# Altium schematic sheet BW1098FFC_TopLevel.SchDoc: =project_title
size Tabloid; PageSetup: Record=PageOptions|CenterHorizontal=True|CenterVertical=True|PrintScale=0.73|XCorrection=1.00|YCorrection=1.00|PrintKind=0|BorderSize=5000000|LeftOffset=0|BottomOffset=0|Orientation=2|PaperLength=1000|PaperWidth=1000|Scale=100|PaperSource=7|PrintQuality=-4|MediaType=1|DitherType=10|PaperKind=A4|PrintScaleMode=1; CompanyName: Luxonis Holding; Organization: Luxonis Holding; Address1: 1925 Harmony Park Drive; Address2: Westminster, CO; Address3: 80234; Address4: United States; SheetNumber: 2; SheetTotal: 5
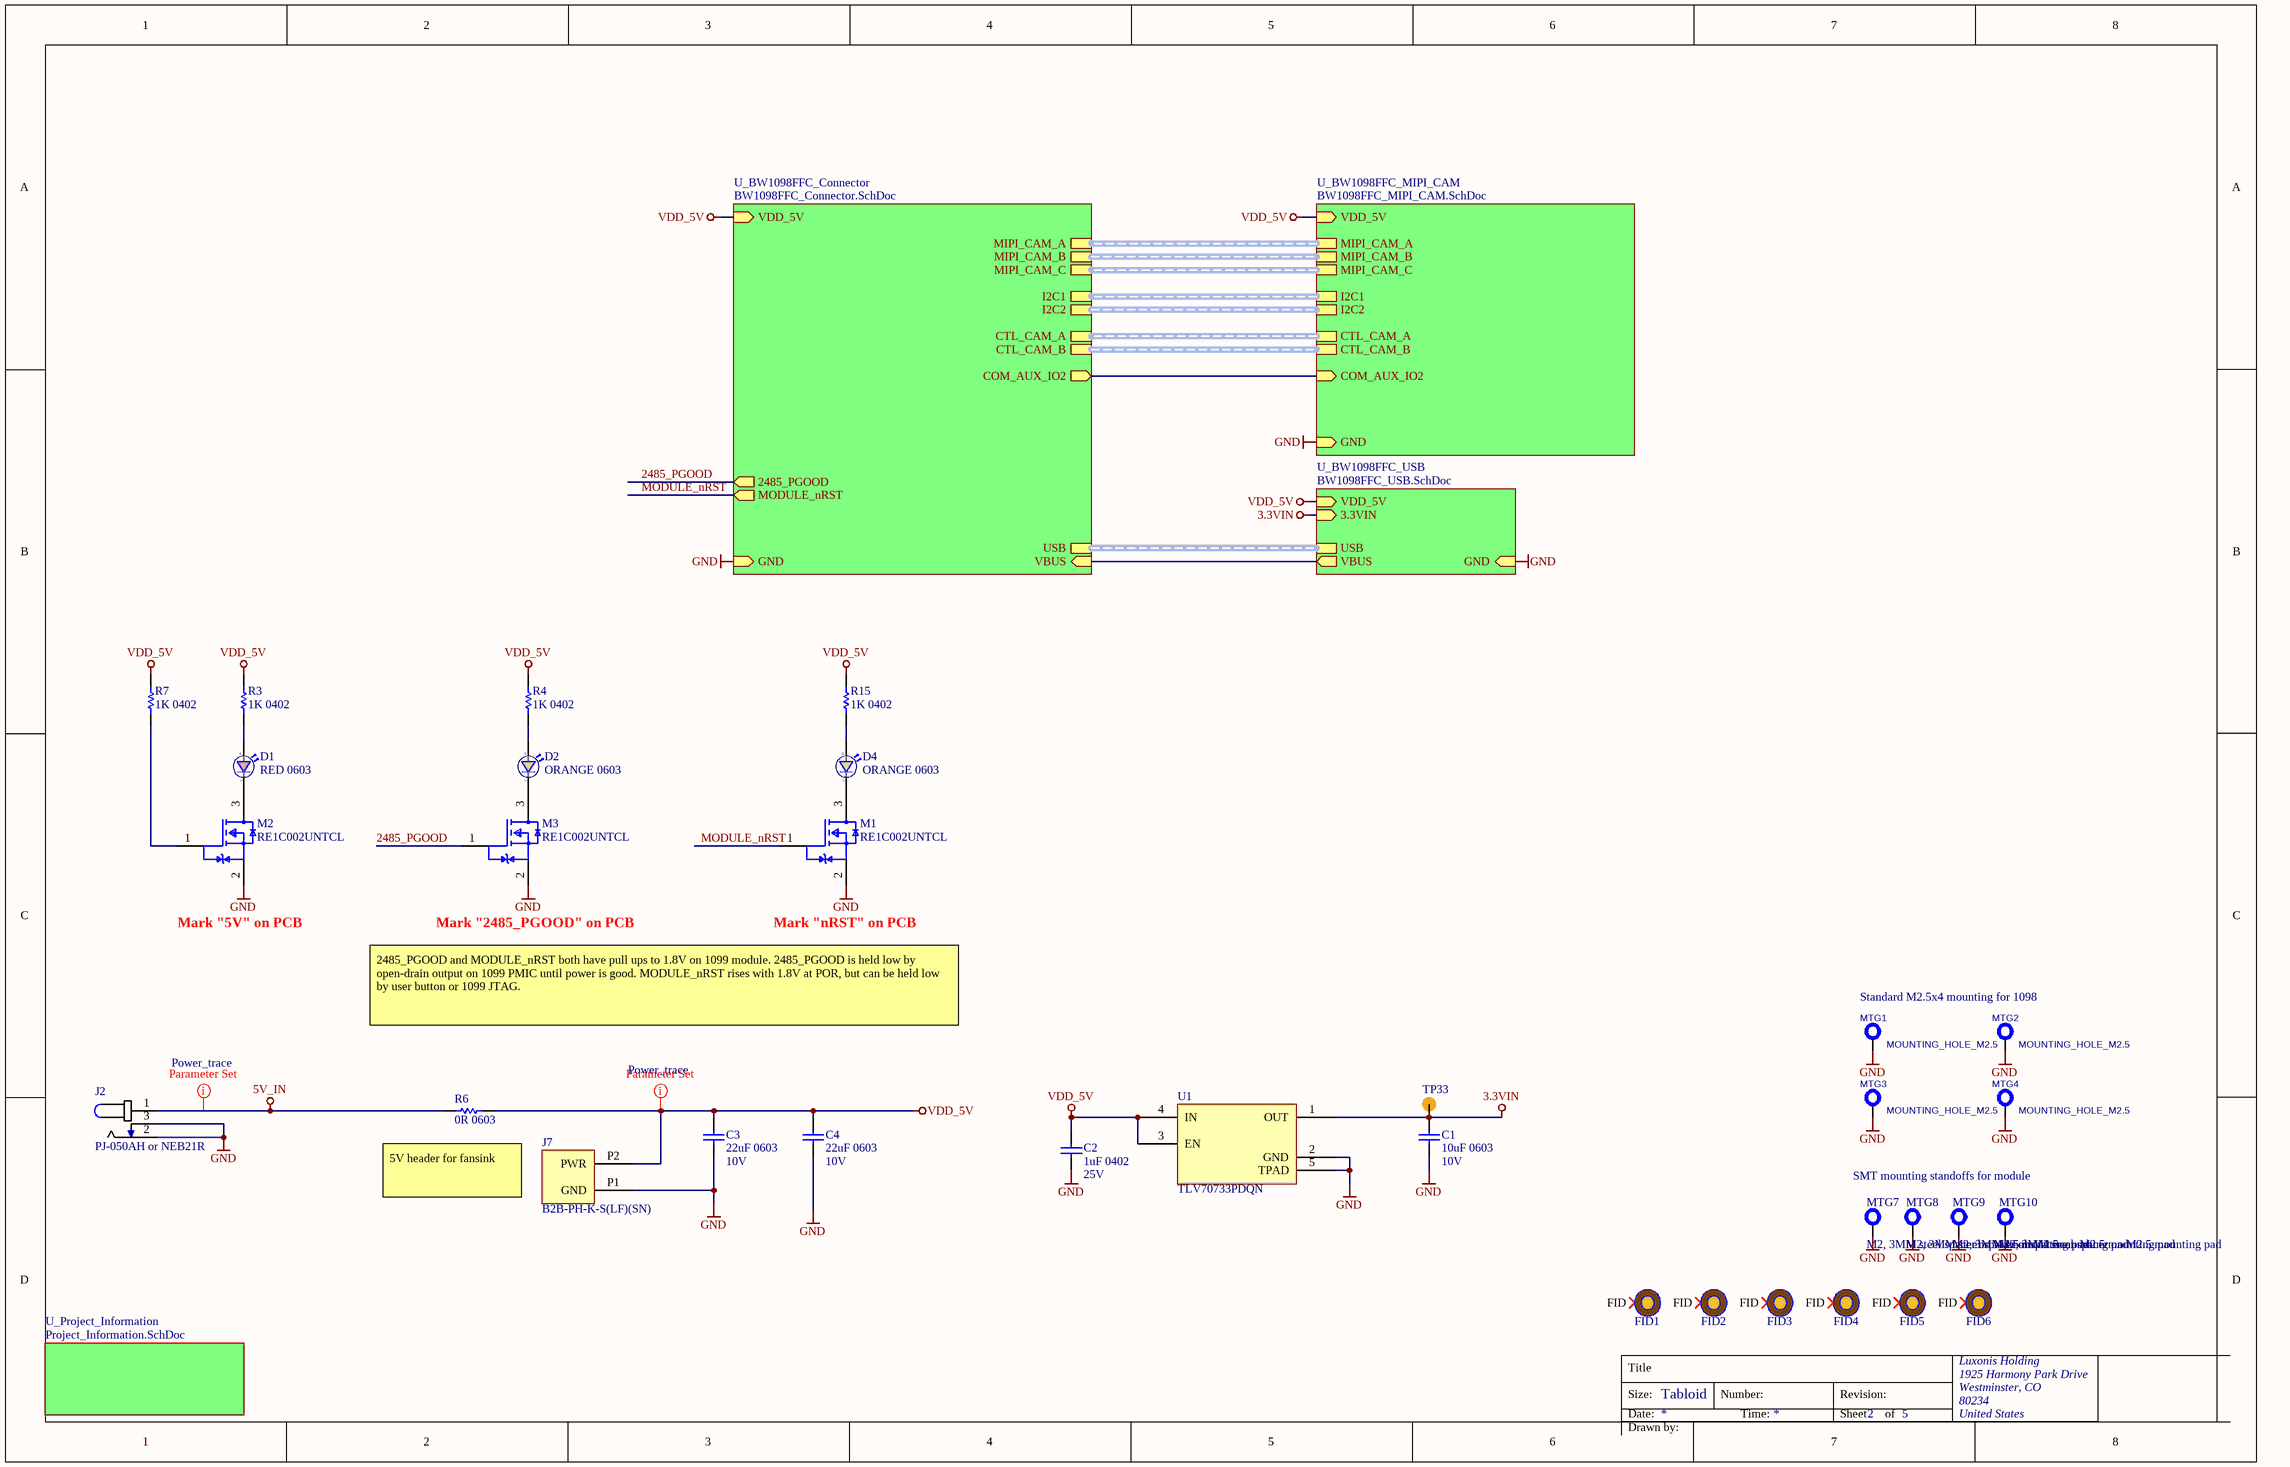
[diagram p0: BW1098FFC_TopLevel.SchDoc]

## Parts
C1  10uF 0603  Voltage Rating: 10V  [CAPC0603(1608)100_N]
C2  1uF 0402  Voltage Rating: 25V  [CAPC0402(1005)70_N]
C3  22uF 0603  Voltage Rating: 10V  [CAPC0603(1608)100_N]
C4  22uF 0603  Voltage Rating: 10V  [CAPC0603(1608)100_N]
D1  RED 0603  [SML_D1xx8W]
D2  ORANGE 0603  [SML_D1xx8W]
D4  ORANGE 0603  [SML_D1xx8W]
FID1  FIDUCIAL_ROUND_1MM  [FIDUCIAL_ROUND_1MM]  (value not drawn)  (no BOM)
FID2  FIDUCIAL_ROUND_1MM  [FIDUCIAL_ROUND_1MM]  (value not drawn)  (no BOM)
FID3  FIDUCIAL_ROUND_1MM  [FIDUCIAL_ROUND_1MM]  (value not drawn)  (no BOM)
FID4  FIDUCIAL_ROUND_1MM  [FIDUCIAL_ROUND_1MM]  (value not drawn)  (no BOM)
FID5  FIDUCIAL_ROUND_1MM  [FIDUCIAL_ROUND_1MM]  (value not drawn)  (no BOM)
FID6  FIDUCIAL_ROUND_1MM  [FIDUCIAL_ROUND_1MM]  (value not drawn)  (no BOM)
J2  PJ-050AH or NEB21R  [PJ-050AH/NEB21R_COMBO]
J7  B2B-PH-K-S(LF)(SN)  [B2B-PH-K-S(LF)(SN)]
M1  RE1C002UNTCL  [RE1C002UNTCL]
M2  RE1C002UNTCL  [RE1C002UNTCL]
M3  RE1C002UNTCL  [RE1C002UNTCL]
MTG1  MOUNTING_HOLE_M2.5  [MOUNTING_HOLE_M2.5]  (no BOM)
MTG2  MOUNTING_HOLE_M2.5  [MOUNTING_HOLE_M2.5]  (no BOM)
MTG3  MOUNTING_HOLE_M2.5  [MOUNTING_HOLE_M2.5]  (no BOM)
MTG4  MOUNTING_HOLE_M2.5  [MOUNTING_HOLE_M2.5]  (no BOM)
MTG7  M2, 3MM steel spacer on M2.5 mounting pad  [9774030243R]
MTG8  M2, 3MM steel spacer on M2.5 mounting pad  [9774030243R]
MTG9  M2, 3MM steel spacer on M2.5 mounting pad  [9774030243R]
MTG10  M2, 3MM steel spacer on M2.5 mounting pad  [9774030243R]
R3  1K 0402  [RESC0402(1005)_N]
R4  1K 0402  [RESC0402(1005)_N]
R6  0R 0603  [RESC0603(1608)_N]
R7  1K 0402  [RESC0402(1005)_N]
R15  1K 0402  [RESC0402(1005)_N]
TP33  TP100_200_NS  [TP100_200_NS]  (value not drawn)  (no BOM)
U1  TLV70733PDQN  [TLV70733PDQN]

## Sub-sheets
U_BW1098FFC_Connector = BW1098FFC_Connector.SchDoc: MIPI_CAM_B (harness MIPI_CAM_B), MIPI_CAM_A (harness MIPI_CAM_A), MIPI_CAM_C (harness MIPI_CAM_C), I2C2 (harness I2C2), I2C1 (harness I2C1), VDD_5V (in), GND (in), 2485_PGOOD (out), MODULE_nRST (out), VBUS (in), COM_AUX_IO2 (out), CTL_CAM_B (harness CTL_CAM_B), CTL_CAM_A (harness CTL_CAM_A), USB (harness USB)
U_BW1098FFC_MIPI_CAM = BW1098FFC_MIPI_CAM.SchDoc: MIPI_CAM_B (harness MIPI_CAM_B), I2C2 (harness I2C2), I2C1 (harness I2C1), MIPI_CAM_A (harness MIPI_CAM_A), MIPI_CAM_C (harness MIPI_CAM_C), VDD_5V (in), GND (in), CTL_CAM_B (harness CTL_CAM_B), CTL_CAM_A (harness CTL_CAM_A), COM_AUX_IO2 (in)
U_BW1098FFC_USB = BW1098FFC_USB.SchDoc: VBUS (out), GND (in), 3.3VIN (in), VDD_5V (in), USB (harness USB)
U_Project_Information = Project_Information.SchDoc: no entries

## Nets
3.3VIN: C1.2 TP33.1 U1.1(OUT) ; sheet U_BW1098FFC_USB/3.3VIN
5V_IN: J2.1 R6.1
GND: C1.1 C2.1 C3.1 C4.1 J2.2 J2.3 J7.P1(GND) M1.2(Source) M2.2(Source) M3.2(Source) MTG1.1 MTG2.1 MTG3.1 MTG4.1 MTG7.1 MTG8.1 MTG9.1 MTG10.1 U1.2(GND) U1.5(TPAD) ; sheet U_BW1098FFC_Connector/GND, sheet U_BW1098FFC_USB/GND, sheet U_BW1098FFC_MIPI_CAM/GND
VDD_5V: C2.2 C3.2 C4.2 J7.P2(PWR) R3.2 R4.2 R6.2 R7.2 R15.2 U1.3(EN) U1.4(IN) ; sheet U_BW1098FFC_Connector/VDD_5V, sheet U_BW1098FFC_USB/VDD_5V, sheet U_BW1098FFC_MIPI_CAM/VDD_5V
2485_PGOOD: M3.1(Gate) ; sheet U_BW1098FFC_Connector/2485_PGOOD
MODULE_nRST: M1.1(Gate) ; sheet U_BW1098FFC_Connector/MODULE_nRST
NetD1_1: D1.1(C) M2.3(Drain)
NetD1_2: D1.2(A) R3.1
NetD2_1: D2.1(C) M3.3(Drain)
NetD2_2: D2.2(A) R4.1
NetD4_1: D4.1(C) M1.3(Drain)
NetD4_2: D4.2(A) R15.1
NetM2_1: M2.1(Gate) R7.1
(unnamed): sheet U_BW1098FFC_Connector/VBUS, sheet U_BW1098FFC_USB/VBUS
(unnamed): sheet U_BW1098FFC_Connector/COM_AUX_IO2, sheet U_BW1098FFC_MIPI_CAM/COM_AUX_IO2

Not connected (* = marked no-connect by the designer): FID1 FID*; FID2 FID*; FID3 FID*; FID4 FID*; FID5 FID*; FID6 FID*

## Buses and harness runs
harness sheet U_BW1098FFC_Connector/CTL_CAM_A = sheet U_BW1098FFC_MIPI_CAM/CTL_CAM_A
harness sheet U_BW1098FFC_Connector/CTL_CAM_B = sheet U_BW1098FFC_MIPI_CAM/CTL_CAM_B
harness sheet U_BW1098FFC_Connector/I2C1 = sheet U_BW1098FFC_MIPI_CAM/I2C1
harness sheet U_BW1098FFC_Connector/I2C2 = sheet U_BW1098FFC_MIPI_CAM/I2C2
harness sheet U_BW1098FFC_Connector/MIPI_CAM_A = sheet U_BW1098FFC_MIPI_CAM/MIPI_CAM_A
harness sheet U_BW1098FFC_Connector/MIPI_CAM_B = sheet U_BW1098FFC_MIPI_CAM/MIPI_CAM_B
harness sheet U_BW1098FFC_Connector/MIPI_CAM_C = sheet U_BW1098FFC_MIPI_CAM/MIPI_CAM_C
harness sheet U_BW1098FFC_Connector/USB = sheet U_BW1098FFC_USB/USB

## Layout directives
net class Power_trace: 5V_IN, VDD_5V

## Notes on the sheet
- Mark "5V" on PCB
- Mark "2485_PGOOD" on PCB
- Mark "nRST" on PCB
- 2485_PGOOD and MODULE_nRST both have pull ups to 1.8V on 1099 module. 2485_PGOOD is held low by open-drain output on 1099 PMIC until power is good. MODULE_nRST rises with 1.8V at POR, but can be held low by user button or 1099 JTAG.
- Standard M2.5x4 mounting for 1098
- (near R6) 5V header for fansink
- SMT mounting standoffs for module
- Title
- Size:
- Date:
- Tabloid
- Number:
- Time:
- Revision:
- Sheet
- of
- Drawn by:

## Library data of the parts
C1 = GRM188R61A106ME69D: CAP CER 10UF 10V X5R 0603 20%; Manufacturer 1: Murata; Material: Ceramic; Supplier 1: Digi-Key; Manufacturer Part Number 1: GRM188R61A106ME69D; Stock 1: 2873098; Pricing 1: 1=0.21000, 10=0.14100, 100=0.07130, 500=0.04876, 1000=0.04313 (USD); RoHS: Yes; Mount: Surface Mount; Case/Package: 0603; Weight: 0.000222oz; Case Code (Metric): 1608; Case Code (Imperial): 0603; Min Operating Temperature: -55°C; Max Operating Temperature: 85°C; Packaging: Tape and Reel; Tolerance: 20%; Capacitance: 10uF; Dielectric: X5R; Voltage Rating (DC): 10V; Package Quantity: 4000; Termination: SMD/SMT; Length: 1.6mm; Height: 0.8mm; Width: 0.8mm; Thickness: 0.035inch; Depth: 0.8mm; REACH SVHC: Unknown; Lead Free: Lead Free; ComponentLink1URL: http://www.mouser.com/ds/2/281/c02e-2905.pdf?src-supplier=Mouser; ComponentLink1Description: http://www.mouser.com/ds/2/281/c02e-2905.pdf?src-supplier=Mouser; ComponentLink2URL: http://components.arrow.com/part/dataview/0323_06119472?src-supplier=Arrow+Europe; ComponentLink2Description: http://components.arrow.com/part/dataview/0323_06119472?src-supplier=Arrow+Europe; ComponentLink3URL: http://www.farnell.com/datasheets/2048014.pdf?src-supplier=Farnell; ComponentLink3Description: http://www.farnell.com/datasheets/2048014.pdf?src-supplier=Farnell; ComponentLink4URL: http://www.farnell.com/datasheets/1872210.pdf?src-supplier=Farnell; ComponentLink4Description: http://www.farnell.com/datasheets/1872210.pdf?src-supplier=Farnell; ComponentLink5URL: http://search.murata.co.jp/Ceramy/image/img/A01X/G101/ENG/GRM188R61A106ME69-01.pdf?src-supplier=Digi-Key; ComponentLink5Description: http://search.murata.co.jp/Ceramy/image/img/A01X/G101/ENG/GRM188R61A106ME69-01.pdf?src-supplier=Digi-Key; ComponentLink6URL: http://www.farnell.com/datasheets/1872210.pdf?src-supplier=Newark; ComponentLink6Description: http://www.farnell.com/datasheets/1872210.pdf?src-supplier=Newark; ComponentLink7URL: http://www.farnell.com/datasheets/2048014.pdf?src-supplier=Element14; ComponentLink7Description: http://www.farnell.com/datasheets/2048014.pdf?src-supplier=Element14; ComponentLink8URL: http://www.farnell.com/datasheets/2048014.pdf?src-supplier=Newark; ComponentLink8Description: http://www.farnell.com/datasheets/2048014.pdf?src-supplier=Newark; Supplier Part Number 1: 490-10475-1-ND
C2 = GRM155R61E105KA12D: CAP CER 1UF 25V X5R 0402 10%; Manufacturer 1: Murata; Material: Ceramic; Supplier 1: Digi-Key; Manufacturer Part Number 1: GRM155R61E105KA12D; Stock 1: 200653; Pricing 1: 1=0.10000, 10=0.07100, 100=0.03350, 500=0.02352, 1000=0.01947, 2500=0.01812, 5000=0.01658 (USD); RoHS: Yes; Mount: Surface Mount; Case/Package: 0402; Weight: 0.000212oz; Case Code (Metric): 1005; Case Code (Imperial): 0402; Min Operating Temperature: -55°C; Max Operating Temperature: 85°C; Tolerance: 10%; Capacitance: 1uF; Dielectric: X5R; Voltage Rating (DC): 25V; Packaging: Tape and Reel; Package Quantity: 10000; Termination: SMD/SMT; Voltage: 25V; Length: 1mm; Height: 0.5mm; Width: 0.5mm; Thickness: 0.022inch; Depth: 0.5mm; Lead Free: Lead Free; REACH SVHC: No SVHC; ComponentLink1URL: https://datasheet.ciiva.com/22732/1666664-22732122.pdf?src-supplier=Element14; ComponentLink1Description: https://datasheet.ciiva.com/22732/1666664-22732122.pdf?src-supplier=Element14; ComponentLink2URL: https://datasheet.ciiva.com/7719/1666664-7719006.pdf?src-supplier=Element14; ComponentLink2Description: https://datasheet.ciiva.com/7719/1666664-7719006.pdf?src-supplier=Element14; Supplier Part Number 1: 490-10017-1-ND
C3 C4 = GRM188R61A226ME15D: CAP CER 22UF 10V X5R 0603 20%; Manufacturer 1: Murata; Material: Ceramic; ComponentLink1URL: https://datasheet.ciiva.com/46444/1769893-46444975.pdf?src-supplier=Element14; ComponentLink1Description: https://datasheet.ciiva.com/46444/1769893-46444975.pdf?src-supplier=Element14; Supplier 1: Digi-Key; Manufacturer Part Number 1: GRM188R61A226ME15D; Stock 1: 984716; Pricing 1: 1=0.31000, 10=0.21500, 100=0.12160, 500=0.08584, 1000=0.07512 (USD); RoHS: Yes; Mount: Surface Mount; Case/Package: 0603; Weight: 0.000222oz; Case Code (Metric): 1608; Case Code (Imperial): 0603; Min Operating Temperature: -55°C; Max Operating Temperature: 85°C; Capacitance: 22uF; Tolerance: 20%; Packaging: Tape and Reel; Dielectric: X5R; Voltage Rating (DC): 10V; Termination: SMD/SMT; Package Quantity: 4000; Length: 1.6mm; Height: 0.8mm; Width: 0.8mm; Thickness: 0.039inch; Depth: 0.8mm; REACH SVHC: No SVHC; Lead Free: Lead Free; Supplier Part Number 1: 490-10476-1-ND
D1 = SML-D12U8WT86: LED RED DIFFUSED 0603 SMD Red 620nm LED Indication - Discrete 2.2V 0603 (1608 Metric); Manufacturer 1: Rohm; Lens Color: White,Clear,Diffused; Lens Style: Rectangular,Diffused,Colorless; Forward Current: 20mA; Luminous Intensity: 63mcd; Number of LEDs: 1; Viewing Angle: 160°; RoHS: Yes; Mount: Surface Mount; Case/Package: 0603; Number of Pins: 2; Color: Red; Case Code (Metric): 1608; Case Code (Imperial): 0603; Min Operating Temperature: -40°C; Max Operating Temperature: 85°C; Forward Voltage: 2.2V; Packaging: Tape and Reel; Dominant Wavelength: 620nm; Wavelength: 620nm; Package Quantity: 1; Illumination Color: Red; Test Current: 20mA; Lens Transparency: Diffused; Length: 1.6mm; Height: 0.65mm; Width: 0.8mm; Radiation Hardening: No; REACH SVHC: No SVHC; Lead Free: Lead Free; ComponentLink1URL: https://datasheet.ciiva.com/11774/0900766b80df3ada-11774020.pdf?src-supplier=RSComponents; ComponentLink1Description: https://datasheet.ciiva.com/11774/0900766b80df3ada-11774020.pdf?src-supplier=RSComponents; ComponentLink2URL: https://datasheet.ciiva.com/2110/sml-d1-2110375.pdf?src-supplier=Digi-Key; ComponentLink2Description: https://datasheet.ciiva.com/2110/sml-d1-2110375.pdf?src-supplier=Digi-Key; ComponentLink3URL: https://datasheet.ciiva.com/2110/sml-d1-2110376.pdf?src-supplier=Digi-Key; ComponentLink3Description: https://datasheet.ciiva.com/2110/sml-d1-2110376.pdf?src-supplier=Digi-Key; ComponentLink4URL: https://datasheet.ciiva.com/2110/sml-d1-2110377.pdf?src-supplier=Digi-Key; ComponentLink4Description: https://datasheet.ciiva.com/2110/sml-d1-2110377.pdf?src-supplier=Digi-Key; ComponentLink5URL: https://datasheet.ciiva.com/9324/sml-d1-9324826.pdf?src-supplier=Avnet; ComponentLink5Description: https://datasheet.ciiva.com/9324/sml-d1-9324826.pdf?src-supplier=Avnet; ComponentLink6URL: https://datasheet.ciiva.com/17420/sml-d1-17420939.pdf?src-supplier=Avnet+Europe; ComponentLink6Description: https://datasheet.ciiva.com/17420/sml-d1-17420939.pdf?src-supplier=Avnet+Europe; Supplier 1: Digi-Key; Manufacturer Part Number 1: SML-D12U8WT86; Stock 1: 63748; Pricing 1: 1=0.33000, 10=0.23900, 100=0.11340, 500=0.07560, 1000=0.05922 (USD); Supplier Part Number 1: 511-1580-1-ND
D2 D4 = SML-D12D8WT86: LED ORANGE DIFFUSED 0603 SMD Orange 605nm LED Indication - Discrete 2.2V 0603 (1608 Metric); Manufacturer 1: Rohm; Lens Color: White; Lens Style: Diffused,Colorless,Rectangular; Number of LEDs: 1; Viewing Angle: 160°; Forward Current: 20mA; Luminous Intensity: 100mcd; Supplier 1: Digi-Key; Stock 1: 29355; Pricing 1: 1=0.33000, 10=0.23900, 100=0.11340, 500=0.07560, 1000=0.05922 (USD); RoHS: Yes; Mount: Surface Mount; Case/Package: 0603; Number of Pins: 2; Color: Orange; Case Code (Metric): 1608; Case Code (Imperial): 0603; Min Operating Temperature: -40°C; Max Operating Temperature: 85°C; Dominant Wavelength: 605nm; Forward Voltage: 2.2V; Package Quantity: 1; Packaging: Tape and Reel; Illumination Color: Orange; Test Current: 20mA; Lens Transparency: Diffused; Wavelength: 605nm; Length: 1.6mm; Height: 0.65mm; Width: 0.8mm; Radiation Hardening: No; REACH SVHC: Unknown; Lead Free: Lead Free; ComponentLink1URL: https://datasheet.ciiva.com/2115/sml-d1-2115577.pdf?src-supplier=Digi-Key; ComponentLink1Description: https://datasheet.ciiva.com/2115/sml-d1-2115577.pdf?src-supplier=Digi-Key; ComponentLink2URL: https://datasheet.ciiva.com/2115/sml-d1-2115578.pdf?src-supplier=Digi-Key; ComponentLink2Description: https://datasheet.ciiva.com/2115/sml-d1-2115578.pdf?src-supplier=Digi-Key; ComponentLink3URL: https://datasheet.ciiva.com/3161/sml-d1-3161418.pdf?src-supplier=Avnet; ComponentLink3Description: https://datasheet.ciiva.com/3161/sml-d1-3161418.pdf?src-supplier=Avnet; ComponentLink4URL: https://datasheet.ciiva.com/16387/sml-d1-16387850.pdf?src-supplier=Future+Electronics; ComponentLink4Description: https://datasheet.ciiva.com/16387/sml-d1-16387850.pdf?src-supplier=Future+Electronics; ComponentLink5URL: https://datasheet.ciiva.com/2115/sml-d1-2115579.pdf?src-supplier=Digi-Key; ComponentLink5Description: https://datasheet.ciiva.com/2115/sml-d1-2115579.pdf?src-supplier=Digi-Key; ComponentLink6URL: https://datasheet.ciiva.com/17419/sml-d1-17419886.pdf?src-supplier=Avnet+Europe; ComponentLink6Description: https://datasheet.ciiva.com/17419/sml-d1-17419886.pdf?src-supplier=Avnet+Europe; Supplier Part Number 1: 511-1577-1-ND; Manufacturer Part Number 1: SML-D12D8WT86
FID1-FID6 = FIDUCIAL: Fiducial with various available footprints
J2 = PJ-050AH/NEB21R_COMBO: CONN POWER PIN 2 POS RA PTH Barrel jack 2.1mm x 5.5mm combo footprint; Manufacturer 1: CUI; Gender: Male; Shielding: Unshielded; Current Rating: 5A; Voltage Rating: 24V; Insulation Resistance: 100MR; Number of Conductors: 2; Max Current Rating: 3A; Voltage Rating (DC): 12V; Number of Ports: 1; Inside Diameter: 6mm; Supplier 1: Mouser; Manufacturer Part Number 1: PJ-050AH; Stock 1: 2665; Pricing 1: 1=0.78000, 10=0.68800, 50=0.62100, 100=0.59400, 1000=0.43200, 10000=0.39100 (USD); Mount: Through Hole; Color: Black; Contact Material: Copper; Contact Plating: Nickel; Housing Color: Black; Housing Material: Thermoplastic; Min Operating Temperature: -25°C; Max Operating Temperature: 85°C; Package Quantity: 500; Termination: Solder; Connector Type: Jack; Contact Gender: Male; Orientation: Horizontal; Lead Free: Lead Free; Flammability Rating: UL94 V-0; ComponentLink1URL: http://www.mouser.com/ds/2/670/PJ-050AH-524150.pdf?src-supplier=Mouser; ComponentLink1Description: http://www.mouser.com/ds/2/670/PJ-050AH-524150.pdf?src-supplier=Mouser; ComponentLink2URL: https://www.cui.com/product/resource/digikeypdf/pj-050ah.pdf?src-supplier=Digi-Key; ComponentLink2Description: https://www.cui.com/product/resource/digikeypdf/pj-050ah.pdf?src-supplier=Digi-Key; ComponentLink3URL: http://datasheet.octopart.com/PJ-050AH-CUI-datasheet-15696426.pdf?src-supplier=CUI; ComponentLink3Description: http://datasheet.octopart.com/PJ-050AH-CUI-datasheet-15696426.pdf?src-supplier=CUI; ComponentLink4URL: http://datasheet.octopart.com/PJ-050AH-CUI-datasheet-62089837.pdf?src-supplier=CUI; ComponentLink4Description: http://datasheet.octopart.com/PJ-050AH-CUI-datasheet-62089837.pdf?src-supplier=CUI; ComponentLink5URL: http://datasheet.octopart.com/PJ-050AH-CUI-datasheet-65972796.pdf?src-supplier=CUI; ComponentLink5Description: http://datasheet.octopart.com/PJ-050AH-CUI-datasheet-65972796.pdf?src-supplier=CUI; ComponentLink6URL: http://datasheet.octopart.com/PJ-050AH-CUI-datasheet-103766550.pdf?src-supplier=CUI; ComponentLink6Description: http://datasheet.octopart.com/PJ-050AH-CUI-datasheet-103766550.pdf?src-supplier=CUI; ComponentLink7URL: http://datasheet.octopart.com/PJ-050AH-CUI-datasheet-103111417.pdf?src-supplier=Electro+Sonic; ComponentLink7Description: http://datasheet.octopart.com/PJ-050AH-CUI-datasheet-103111417.pdf?src-supplier=Electro+Sonic; ComponentLink8URL: http://datasheet.octopart.com/PJ-050AH-CUI-datasheet-34390405.pdf?src-supplier=Future+Electronics; ComponentLink8Description: http://datasheet.octopart.com/PJ-050AH-CUI-datasheet-34390405.pdf?src-supplier=Future+Electronics; ComponentLink9URL: http://datasheet.octopart.com/PJ-050AH-CUI-datasheet-62073522.pdf?src-supplier=Future+Electronics; ComponentLink9Description: http://datasheet.octopart.com/PJ-050AH-CUI-datasheet-62073522.pdf?src-supplier=Future+Electronics; ComponentLink10URL: http://datasheet.octopart.com/PJ-050AH-CUI-datasheet-102985732.pdf?src-supplier=Future+Electronics; ComponentLink10Description: http://datasheet.octopart.com/PJ-050AH-CUI-datasheet-102985732.pdf?src-supplier=Future+Electronics; Supplier 2: Newark; Manufacturer 2: Lumberg; Manufacturer Part Number 2: NEB 21 R; Stock 2: 56; Pricing 2: 1=0.86400, 25=0.82100, 50=0.78300, 100=0.72900, 250=0.68600 (USD); Number of Pins: 2; Number of Terminals: 3; Packaging: Bulk; Max Voltage Rating (DC): 12V; Voltage Rating (AC): 12V; Length: 9mm; Depth: 14.5mm; REACH SVHC: No SVHC; ComponentLink11URL: https://datasheet.ciiva.com/11720/0900766b805694d6-11720273.pdf?src-supplier=RSComponents; ComponentLink11Description: https://datasheet.ciiva.com/11720/0900766b805694d6-11720273.pdf?src-supplier=RSComponents; ComponentLink12URL: https://datasheet.ciiva.com/1115/28897-1115898.pdf?src-supplier=Newark; ComponentLink12Description: https://datasheet.ciiva.com/1115/28897-1115898.pdf?src-supplier=Newark; ComponentLink13URL: https://datasheet.ciiva.com/8066/1700582-8066298.pdf?src-supplier=Element14; ComponentLink13Description: https://datasheet.ciiva.com/8066/1700582-8066298.pdf?src-supplier=Element14; ComponentLink14URL: https://datasheet.ciiva.com/29365/738882-da-01-ml-netzger-einbaukuppl-neb-21-r-de-en-fr-29365351.pdf?src-supplier=Conrad; ComponentLink14Description: https://datasheet.ciiva.com/29365/738882-da-01-ml-netzger-einbaukuppl-neb-21-r-de-en-fr-29365351.pdf?src-supplier=Conrad; ComponentLink15URL: http://datasheet.octopart.com/NEB-21-R-Lumberg-datasheet-15206778.pdf?src-supplier=Newark; ComponentLink15Description: http://datasheet.octopart.com/NEB-21-R-Lumberg-datasheet-15206778.pdf?src-supplier=Newark; ComponentLink16URL: http://datasheet.octopart.com/NEB-21-R-Lumberg-datasheet-103789672.pdf?src-supplier=Farnell; ComponentLink16Description: http://datasheet.octopart.com/NEB-21-R-Lumberg-datasheet-103789672.pdf?src-supplier=Farnell; ComponentLink17URL: http://datasheet.octopart.com/NEB-21-R-Lumberg-datasheet-136395310.pdf?src-supplier=Toby+Electronics; ComponentLink17Description: http://datasheet.octopart.com/NEB-21-R-Lumberg-datasheet-136395310.pdf?src-supplier=Toby+Electronics; Supplier Part Number 1: 490-PJ-050AH; Supplier Part Number 2: 97K6458; Supplier 3: Digi-Key; Supplier Part Number 3: CP-050AH-ND; Supplier 4: Element14; Supplier Part Number 4: 1217037
J7 = B2B-PH-K-S(LF)(SN): CONN HEADER VERT 2POS 2MM; Manufacturer 1: JST; Number of Positions: 2; Connector Type: Male Pin; Current Rating: 2A; Gender: Male; Contact Resistance: 20mR; Insulation Resistance: 1MR; Voltage Rating: 100V; Supplier 1: Digi-Key; Stock 1: 216199; Pricing 1: 1 = 0.170000, 10 = 0.162000, 100 = 0.100200, 500 = 0.082880, 1000 = 0.072520, 5000 = 0.062160, 10000 = 0.060440 (USD); RoHS: Yes; Mount: Through Hole; Number of Pins: 2; Contact Plating: Tin; Color: Natural; Contact Material: Brass; Housing Material: Polyamide; Housing Color: White; Min Operating Temperature: -25°C; Max Operating Temperature: 85°C; Number of Rows: 1; Packaging: Bulk; Termination: Solder; Fastening Type: Detent; Number of Poles: 2; Number of Contacts: 2; Orientation: Straight; Max Current Rating: 2A; Max Voltage Rating (AC): 100V; Voltage Rating (AC): 100V; Working Voltage: 100V; Max Voltage Rating (DC): 100V; Length: 5.9mm; Height: 9.4mm; Pitch: 2mm; Width: 4.5mm; Contact Mating Length: 0.13inch; Depth: 4.5mm; Lead Pitch: 2mm; Lead Free: Lead Free; REACH SVHC: No SVHC; ComponentLink1URL: https://datasheet.ciiva.com/6747/80560-6747392.pdf?src-supplier=Newark; ComponentLink1Description: https://datasheet.ciiva.com/6747/80560-6747392.pdf?src-supplier=Newark; ComponentLink2URL: https://datasheet.ciiva.com/11746/0900766b8082f551-11746676.pdf?src-supplier=RSComponents; ComponentLink2Description: https://datasheet.ciiva.com/11746/0900766b8082f551-11746676.pdf?src-supplier=RSComponents; ComponentLink3URL: https://datasheet.ciiva.com/8052/80560-8052022.pdf?src-supplier=Element14; ComponentLink3Description: https://datasheet.ciiva.com/8052/80560-8052022.pdf?src-supplier=Element14; ComponentLink4URL: https://datasheet.ciiva.com/712/eph-712442.pdf?src-supplier=Digi-Key; ComponentLink4Description: https://datasheet.ciiva.com/712/eph-712442.pdf?src-supplier=Digi-Key; ComponentLink5URL: https://datasheet.ciiva.com/16422/b2b-ph-k-slfsn-16422715.pdf?src-supplier=Future+Electronics; ComponentLink5Description: https://datasheet.ciiva.com/16422/b2b-ph-k-slfsn-16422715.pdf?src-supplier=Future+Electronics; Supplier Part Number 1: 455-1704-ND; Manufacturer Part Number 1: B2B-PH-K-S(LF)(SN)
M1-M3 = RE1C002UNTCL: MOSFET N-CH 20V 0.2A EMT3; Manufacturer 1: Rohm; Continuous Drain Current (ID): 200mA; Rds On Max: 1.2R; Input Capacitance: 25pF; Max Power Dissipation: 150mW; RoHS: Yes; Mount: Surface Mount; Case/Package: SOT-89; Packaging: Tape and Reel; Drain to Source Voltage (Vdss): 20V; Lead Free: Lead Free; ComponentLink1URL: http://www.mouser.com/ds/2/348/re1c002untcl-e-1018231.pdf?src-supplier=Mouser; ComponentLink1Description: http://www.mouser.com/ds/2/348/re1c002untcl-e-1018231.pdf?src-supplier=Mouser; ComponentLink2URL: http://rohmfs.rohm.com/en/techdata_basic/transistor/taping/EMT3_TL_taping.pdf?src-supplier=Digi-Key; ComponentLink2Description: http://rohmfs.rohm.com/en/techdata_basic/transistor/taping/EMT3_TL_taping.pdf?src-supplier=Digi-Key; ComponentLink3URL: http://rohmfs.rohm.com/en/products/databook/datasheet/discrete/transistor/mosfet/re1c002un.pdf?src-supplier=Avnet; ComponentLink3Description: http://rohmfs.rohm.com/en/products/databook/datasheet/discrete/transistor/mosfet/re1c002un.pdf?src-supplier=Avnet; ComponentLink4URL: https://www.rohm.com/datasheet/RE1C002UN/re1c002untcl-e?src-supplier=Digi-Key; ComponentLink4Description: https://www.rohm.com/datasheet/RE1C002UN/re1c002untcl-e?src-supplier=Digi-Key; ComponentLink5URL: http://www.farnell.com/datasheets/2704376.pdf?src-supplier=Newark; ComponentLink5Description: http://www.farnell.com/datasheets/2704376.pdf?src-supplier=Newark; ComponentLink6URL: http://www.farnell.com/datasheets/2704376.pdf?src-supplier=Farnell; ComponentLink6Description: http://www.farnell.com/datasheets/2704376.pdf?src-supplier=Farnell; ComponentLink7URL: http://www.farnell.com/datasheets/2704376.pdf?src-supplier=Element14; ComponentLink7Description: http://www.farnell.com/datasheets/2704376.pdf?src-supplier=Element14; Supplier 1: Digi-Key; Manufacturer Part Number 1: RE1C002UNTCL; Stock 1: 868886; Pricing 1: 1=0.20000, 10=0.18200, 100=0.09930, 500=0.06112, 1000=0.04167 (USD); Supplier Part Number 1: RE1C002UNTCLCT-ND
MTG1-MTG4 = MP_Mounting-Holes: =CurrentFootprint; B - Value: Not a Part; A - Level: 0
MTG7-MTG10 = 9774030243R: MP ROUND STANDOFF M2X0.4 STEEL 3MM; Manufacturer 1: Wurth Electronics; Plating: Tin; Threaded/Unthreaded: Threaded; Outside Diameter: 0.171inch; Supplier 1: Digi-Key; Manufacturer Part Number 1: 9774030243R; Stock 1: 20568; Pricing 1: 1=0.95000, 10=0.91800, 50=0.79500, 100=0.73900 (USD); RoHS: Yes; Material: Steel; Length: 0.173inch; REACH SVHC: Unknown; ComponentLink1URL: http://www.mouser.com/ds/2/445/9774030243R-611455.pdf?src-supplier=Mouser; ComponentLink1Description: http://www.mouser.com/ds/2/445/9774030243R-611455.pdf?src-supplier=Mouser; ComponentLink2URL: http://www.farnell.com/datasheets/1960368.pdf?src-supplier=Farnell; ComponentLink2Description: http://www.farnell.com/datasheets/1960368.pdf?src-supplier=Farnell; ComponentLink3URL: https://katalog.we-online.de/em/datasheet/9774030243R.pdf?src-supplier=Digi-Key; ComponentLink3Description: https://katalog.we-online.de/em/datasheet/9774030243R.pdf?src-supplier=Digi-Key; ComponentLink4URL: http://www.farnell.com/datasheets/1960368.pdf?src-supplier=Newark; ComponentLink4Description: http://www.farnell.com/datasheets/1960368.pdf?src-supplier=Newark; ComponentLink5URL: http://www.farnell.com/datasheets/1960368.pdf?src-supplier=Element14; ComponentLink5Description: http://www.farnell.com/datasheets/1960368.pdf?src-supplier=Element14; Supplier Part Number 1: 732-7085-1-ND; Supplier 2: Mouser; Supplier Part Number 2: 710-9774030243R; Supplier 3: Element14; Supplier Part Number 3: 2497599
R3 R4 R7 R15 = RC0402FR-071KL: RES SMD 1K OHM 1% 1/16W 0402 1 kOhms ±1% 0.063W, 1/16W Chip Resistor 0402 (1005 Metric) Moisture Resistant Thick Film; Manufacturer 1: Yageo; Temperature Coefficient: 100ppm/°C; Power Rating: 62.5mW; Voltage Rating (DC): 50V; Resistance: 1kR; RoHS: Yes; Number of Pins: 2; Case Code (Imperial): 0402; Case Code (Metric): 1005; Min Operating Temperature: -55°C; Max Operating Temperature: 155°C; Packaging: Tape and Reel; Composition: Thick Film; Voltage Rating: 50V; Military Standard: Not; Termination: SMD/SMT; Length: 1mm; Height: 0.32mm; Width: 0.5mm; Depth: 0.5mm; Lead Free: Lead Free; REACH SVHC: Unknown; ComponentLink1URL: https://datasheet.ciiva.com/11819/0900766b80c66297-11819477.pdf?src-supplier=RSComponents; ComponentLink1Description: https://datasheet.ciiva.com/11819/0900766b80c66297-11819477.pdf?src-supplier=RSComponents; ComponentLink2URL: https://datasheet.ciiva.com/12666/pyu-rc0402-51-rohs-l-6-r-12666741.pdf?src-supplier=Mouser; ComponentLink2Description: https://datasheet.ciiva.com/12666/pyu-rc0402-51-rohs-l-6-r-12666741.pdf?src-supplier=Mouser; ComponentLink3URL: https://datasheet.ciiva.com/17063/pyu-rc0402-51-rohs-l-6-r-17063193.pdf?src-supplier=Future+Electronics; ComponentLink3Description: https://datasheet.ciiva.com/17063/pyu-rc0402-51-rohs-l-6-r-17063193.pdf?src-supplier=Future+Electronics; ComponentLink4URL: https://datasheet.ciiva.com/22747/1018594-22747513.pdf?src-supplier=Element14; ComponentLink4Description: https://datasheet.ciiva.com/22747/1018594-22747513.pdf?src-supplier=Element14; ComponentLink5URL: https://datasheet.ciiva.com/7849/1018594-7849869.pdf?src-supplier=Element14; ComponentLink5Description: https://datasheet.ciiva.com/7849/1018594-7849869.pdf?src-supplier=Element14; ComponentLink6URL: https://datasheet.ciiva.com/7983/1018594-7983502.pdf?src-supplier=Element14; ComponentLink6Description: https://datasheet.ciiva.com/7983/1018594-7983502.pdf?src-supplier=Element14; ComponentLink7URL: https://datasheet.ciiva.com/7849/1018594-7849871.pdf?src-supplier=Element14; ComponentLink7Description: https://datasheet.ciiva.com/7849/1018594-7849871.pdf?src-supplier=Element14; Supplier 1: Digi-Key; Manufacturer Part Number 1: RC0402FR-071KL; Stock 1: 60695854; Pricing 1: 1=0.10000, 10=0.01600, 100=0.00670, 1000=0.00301, 2500=0.00261, 5000=0.00215 (USD); Case/Package: 0402; Tolerance: 1%; Supplier Part Number 1: 311-1.00KLRCT-ND
R6 = CRCW06030000Z0EA: RES SMD 0 OHM JUMPER 1/10W 0603 0 Ohms Jumper 0.1W, 1/10W Chip Resistor 0603 (1608 Metric) Automotive AEC-Q200 Thick Film; Manufacturer 1: Vishay; Manufacturer Part Number 1: CRCW0603-0000Z0EA; Resistance: 0mR; Power Rating: 100mW; Voltage Rating: 75V; Temperature Coefficient: 100ppm/°C; Tolerance: 5%; Current Rating: 2A; Supplier 1: Digi-Key; Stock 1: 742743; Pricing 1: 1=0.100000, 10=0.034000, 25=0.024400, 50=0.018600, 100=0.013800, 250=0.010480, 500=0.008400, 1000=0.006180 (USD); RoHS: Yes; Mount: Surface Mount; Case/Package: 0603; Weight: 7.1E-05oz; Contact Plating: Tin,Lead; Case Code (Metric): 1608; Case Code (Imperial): 0603; Min Operating Temperature: -55°C; Max Operating Temperature: 155°C; Composition: Thick Film; Termination: SMD/SMT; Packaging: Tape and Reel; Package Quantity: 1; Number of Terminations: 2; Military Standard: Not; Max Power Dissipation: 100mW; Voltage Rating (DC): 75V; Features: Automotive AEC-Q200; Working Voltage: 75V; Length: 1.55mm; Height: 0.02inch; Width: 0.033inch; Depth: 0.85mm; Radiation Hardening: No; Lead Free: Lead Free; REACH SVHC: Unknown; ComponentLink1URL: https://datasheet.ciiva.com/2461/dcrcwe3-2461968.pdf?src-supplier=Digi-Key; ComponentLink1Description: https://datasheet.ciiva.com/2461/dcrcwe3-2461968.pdf?src-supplier=Digi-Key; ComponentLink2URL: https://datasheet.ciiva.com/2461/dcrcwe3-2461969.pdf?src-supplier=Digi-Key; ComponentLink2Description: https://datasheet.ciiva.com/2461/dcrcwe3-2461969.pdf?src-supplier=Digi-Key; ComponentLink3URL: https://datasheet.ciiva.com/2461/dcrcwe3-2461970.pdf?src-supplier=Digi-Key; ComponentLink3Description: https://datasheet.ciiva.com/2461/dcrcwe3-2461970.pdf?src-supplier=Digi-Key; ComponentLink4URL: https://datasheet.ciiva.com/8340/dcrcwe3-8340197.pdf?src-supplier=Avnet; ComponentLink4Description: https://datasheet.ciiva.com/8340/dcrcwe3-8340197.pdf?src-supplier=Avnet; ComponentLink5URL: https://datasheet.ciiva.com/16941/dcrcw-16941302.pdf?src-supplier=Avnet+Europe; ComponentLink5Description: https://datasheet.ciiva.com/16941/dcrcw-16941302.pdf?src-supplier=Avnet+Europe; ComponentLink6URL: https://datasheet.ciiva.com/16199/dcrcwe3-16199063.pdf?src-supplier=Future+Electronics; ComponentLink6Description: https://datasheet.ciiva.com/16199/dcrcwe3-16199063.pdf?src-supplier=Future+Electronics; ComponentLink7URL: https://datasheet.ciiva.com/16725/70201119-16725175.pdf?src-supplier=Allied+Electronics; ComponentLink7Description: https://datasheet.ciiva.com/16725/70201119-16725175.pdf?src-supplier=Allied+Electronics; ComponentLink8URL: https://datasheet.ciiva.com/26316/fld-crcw-e3-data-en-26316615.pdf?src-supplier=Distrelec; ComponentLink8Description: https://datasheet.ciiva.com/26316/fld-crcw-e3-data-en-26316615.pdf?src-supplier=Distrelec; ComponentLink9URL: https://datasheet.ciiva.com/5544/dcrcwe3-109170-5544344.pdf?src-supplier=Mouser; ComponentLink9Description: https://datasheet.ciiva.com/5544/dcrcwe3-109170-5544344.pdf?src-supplier=Mouser; ComponentLink10URL: https://datasheet.ciiva.com/7841/1720486-7841816.pdf?src-supplier=Element14; ComponentLink10Description: https://datasheet.ciiva.com/7841/1720486-7841816.pdf?src-supplier=Element14; ComponentLink11URL: https://datasheet.ciiva.com/7841/1720486-7841817.pdf?src-supplier=Element14; ComponentLink11Description: https://datasheet.ciiva.com/7841/1720486-7841817.pdf?src-supplier=Element14; ComponentLink12URL: https://datasheet.ciiva.com/7841/125364-7841818.pdf?src-supplier=Element14; ComponentLink12Description: https://datasheet.ciiva.com/7841/125364-7841818.pdf?src-supplier=Element14; ComponentLink13URL: https://datasheet.ciiva.com/16721/70201119-16721450.pdf?src-supplier=Allied+Electronics; ComponentLink13Description: https://datasheet.ciiva.com/16721/70201119-16721450.pdf?src-supplier=Allied+Electronics; Supplier Part Number 1: 541-0.0GCT-ND
TP33 = TEST_POINT
U1 = TLV70733PDQN: IC REG LINEAR 3.3V 200MA 4X2SON Linear Voltage Regulator IC  1 Output  200mA 4-X2SON (1x1); Manufacturer 1: Texas Instruments; Manufacturer Part Number 1: TLV70710DQN; Output Voltage: 1V; Number of Regulators: 1; Min Current Limit: 240mA; Quiescent Current: 25uA; Dropout Voltage: 250mV; RoHS: Yes; Mount: Surface Mount; Min Operating Temperature: -40°C; Max Operating Temperature: 125°C; Output Current: 200mA; Packaging: Tape and Reel; Package Quantity: 3000; Lead Free: Lead Free; ComponentLink1URL: http://www.ti.com/lit/gpn/tlv707?src-supplier=Mouser; ComponentLink1Description: http://www.ti.com/lit/gpn/tlv707?src-supplier=Mouser; ComponentLink2URL: http://www.ti.com/lit/ds/symlink/tlv707.pdf?src-supplier=Digi-Key; ComponentLink2Description: http://www.ti.com/lit/ds/symlink/tlv707.pdf?src-supplier=Digi-Key; Supplier 1: Digi-Key; Supplier Part Number 1: 296-28355-1-ND